# EAGLE design jumper_bed2 (EAGLE 9.6.2)
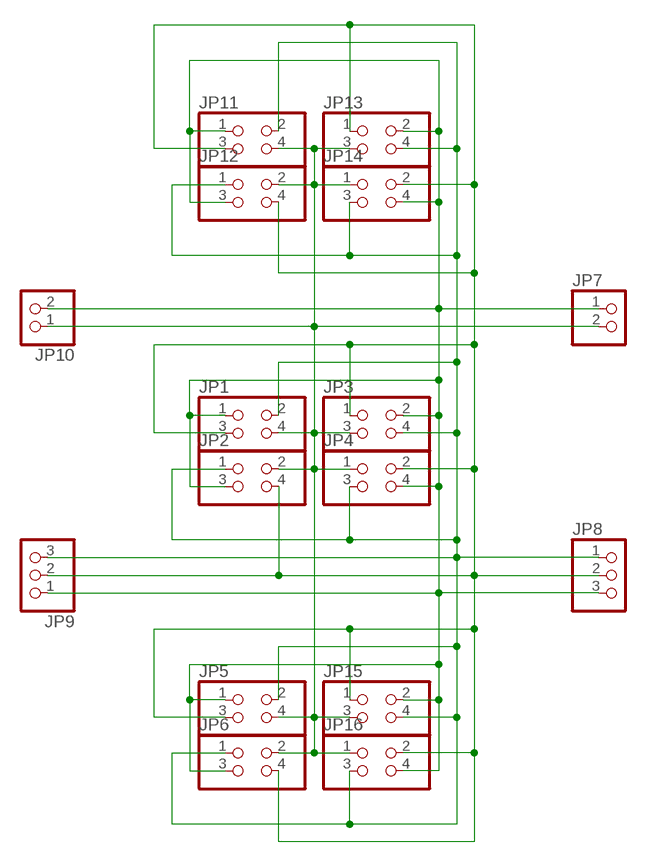
[diagram p0: schematic, sheet 1]

## Parts
JP1  PINHD-2X2  [2X02]
JP2  PINHD-2X2  [2X02]
JP3  PINHD-2X2  [2X02]
JP4  PINHD-2X2  [2X02]
JP5  PINHD-2X2  [2X02]
JP6  PINHD-2X2  [2X02]
JP7  PINHD-1X2/90  [1X02/90]
JP8  PINHD-1X3/90  [1X03/90]
JP9  PINHD-1X31X03/90F  [1X03/90F]
JP10  PINHD-1X21X02/90F  [1X02/90F]
JP11  PINHD-2X2  [2X02]
JP12  PINHD-2X2  [2X02]
JP13  PINHD-2X2  [2X02]
JP14  PINHD-2X2  [2X02]
JP15  PINHD-2X2  [2X02]
JP16  PINHD-2X2  [2X02]

## Nets
GND: JP1.1 JP2.3 JP3.2 JP4.4 JP5.1 JP6.3 JP7.1 JP8.3 JP9.1 JP10.2 JP11.1 JP12.3 JP13.2 JP14.4 JP15.2 JP16.4
SCL: JP1.2 JP2.1 JP3.4 JP4.3 JP5.2 JP6.1 JP8.1 JP9.3 JP11.2 JP12.1 JP13.4 JP14.3 JP15.4 JP16.3
SDA: JP1.3 JP2.4 JP3.1 JP4.2 JP5.3 JP6.4 JP8.2 JP9.2 JP11.3 JP12.4 JP13.1 JP14.2 JP15.1 JP16.2
VCC: JP1.4 JP2.2 JP3.3 JP4.1 JP5.4 JP6.2 JP7.2 JP10.1 JP11.4 JP12.2 JP13.3 JP14.1 JP15.3 JP16.1

## Library data of the parts
JP1-JP6 JP11-JP16 = pinhead2:PINHD-2X2: PIN HEADER
JP7 JP10 = pinhead2:PINHD-1X2: PIN HEADER
JP8 JP9 = pinhead2:PINHD-1X3: PIN HEADER

## Board
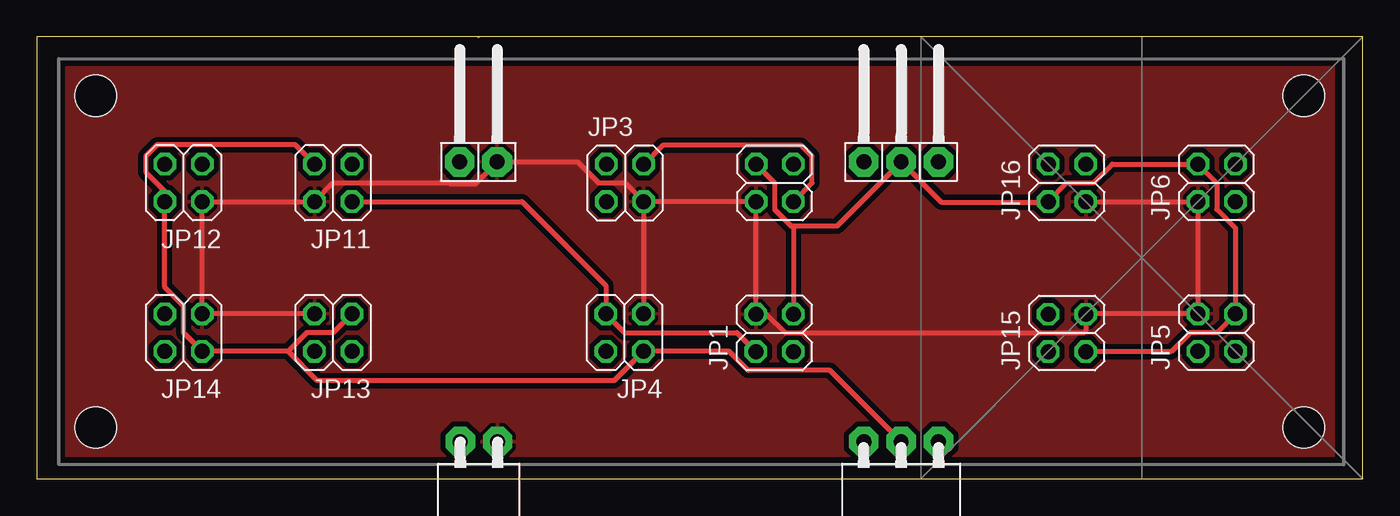
[diagram p1: board, top side]
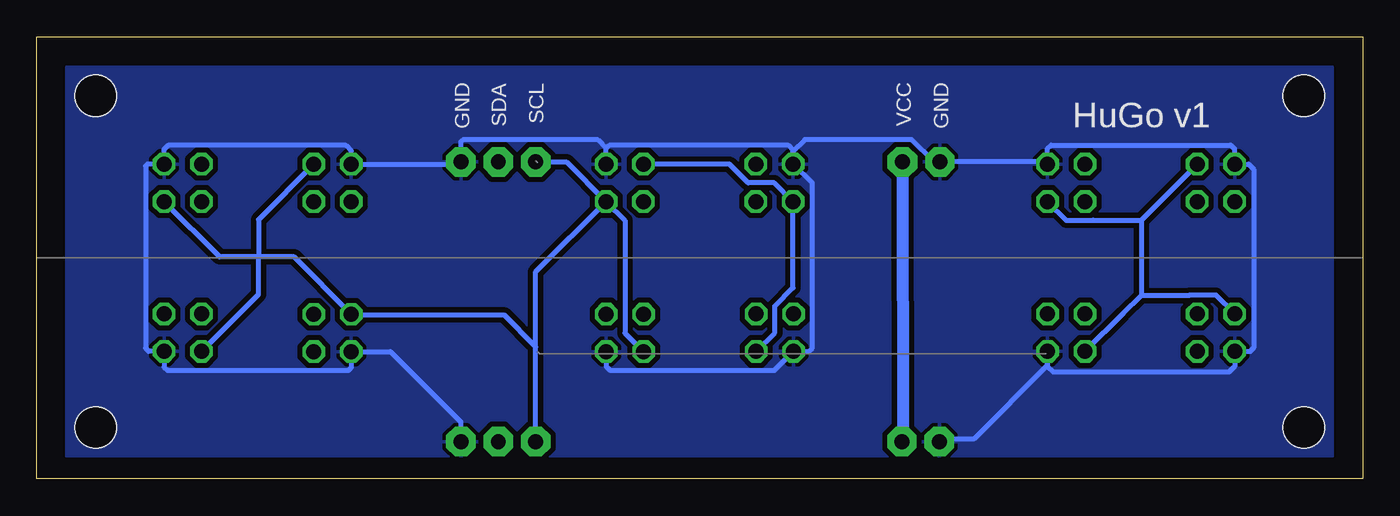
[diagram p2: board, bottom side, seen from below]

Size 90 x 30 mm. Coordinates in mm from the lower left corner, seen from the top.
Outline: 0,0 90,0 90,30 0,30 0,0
Copper layers (1*16): Top 0.035mm / dielectric 1.5mm / Bottom 0.035mm
Design rules "default *": minimum track width 14mil, minimum drill 0.35mm, track to track 14mil, track to pad 13mil, pad to pad 14mil, via to via 14mil, smd to smd 14mil, copper to edge 0mil, drill to drill 15mil, minimum pad ring 10mil, minimum via ring 8mil, stop-mask expansion 4mil, vias tented up to drill 0mil, thermal gap 10mil
Holes 2.8 mm at 86,3.5 86,26 4,26 4,3.5

### Footprints (pad centres in the part's own frame; a part is rotated, then mirrored left to right if it is on the bottom)
2X02 = drill 1.016 octagon: 1 -1.27,-1.27; 2 -1.27,1.27; 3 1.27,-1.27; 4 1.27,1.27
1X02/90 = drill 1.016 pad 1.981 octagon: 1 -1.27,-3.81 | drill 1.016 pad 2.007 octagon: 2 1.27,-3.81
1X03/90 = drill 1.016 pad 1.981 octagon: 1 -2.54,-3.81; 2 0,-3.81; 3 2.54,-3.81
1X03/90F = drill 1.016 pad 1.981 octagon: 1 -2.54,0; 2 0,0; 3 2.54,0
1X02/90F = drill 1.016 pad 1.981 octagon: 1 -1.31,0; 2 1.23,0

### Placement (x,y rotation side)
JP1  50.08,9.91 90 top
JP2  50.09,20.09 90 top
JP3  39.93,20.09 0 top
JP4  39.9,9.93 180 top
JP5  80.09,9.93 90 top
JP6  80.09,20.09 90 top
JP7  29.97,25.32 0 top
JP8  58.67,25.32 0 top
JP9  58.67,2.54 180 top
JP10  29.97,2.54 180 top
JP11  20.12,20.09 180 top
JP12  9.96,20.09 180 top
JP13  20.12,9.93 180 top
JP14  9.96,9.93 180 top
JP15  69.93,9.91 90 top
JP16  69.93,20.09 90 top

### Tracks (layer width: path | path; a pad name or v marks a point on that pad's centre or on a via)
GND
  Bottom 0.356: JP10.2 28.65,2.74 26.36,2.74 21.39,7.72 JP13.2 21.39,7.64 21.01,7.26 9.07,7.26 8.69,7.64 JP14.4 7.62,8.66 7.39,8.89 7.39,21.01 7.74,21.36 JP12.3 8.69,22.38 8.97,22.66 21.16,22.66 21.39,22.43 JP11.1 21.54,21.51 JP7.1 29.11,21.51 30.62,23.02 37.86,23.02 38.66,22.23 JP3.2 | JP3.2 38.66,22.32 38.97,22.63 51.15,22.63 51.36,22.42 JP2.3 51.36,22.45 51.92,23.01 61.1,23.01 61.21,22.9 JP8.3 61.37,21.36 JP16.4 68.66,22.27 69.02,22.63 81.09,22.63 81.36,22.37 JP6.3 82.49,21.36 82.63,21.23 82.63,8.87 82.42,8.66 JP5.1 81.36,7.59 81.13,7.37 68.84,7.37 68.66,7.55 JP15.2 65.99,8.64 61.21,3.86 JP9.1 | JP3.2 37.36,20.07 37.36,8.87 37.57,8.66 JP4.4 39.92,7.37 51.09,7.37 51.35,7.63 JP1.1
  pour Bottom: 2.01,27.97 88.04,27.97 88.04,1.52 2.01,1.52
SCL
  Top 0.356: JP11.2 32.93,18.82 38.63,13.12 JP4.3 38.63,11.18 39.88,9.93 47.52,9.93 JP1.2 | JP3.4 42.48,22.63 51.88,22.63 52.63,21.89 52.63,20.09 JP2.1
  Bottom 0.356: 15.02,17.56 15.02,12.45 | 15.02,17.56 JP12.1 | 15.02,12.45 16.27,11.2 JP13.4 | 15.02,12.45 11.78,12.45 11.75,12.47 9.96,12.47 JP14.3 | 15.02,17.56 18.31,17.56 18.32,17.55 20.12,17.55 JP11.2 | JP8.1 54.05,21.51 JP2.1 | JP1.2 48.83,8.64 50.08,9.89 50.08,17.54 JP2.1 | JP2.1 56.13,14.05 JP9.3 56.13,8.97 58.3,11.13 68.61,11.13 JP15.4 72.54,15.06 74.95,15.06 | JP6.1 77.6,15.06 74.95,15.06 | JP16.3 74.95,17.6 74.95,15.06 | JP5.2 74.95,12.52 74.95,15.06
SDA
  Top 0.356: JP11.3 17.53,22.68 8.18,22.68 7.39,21.9 7.39,20.82 8.69,19.53 JP12.4 8.69,13 9.96,11.73 9.96,9.93 JP14.2 17.05,8.66 | JP13.1 20.12,9.93 18.32,9.93 17.05,8.66 | 17.05,8.66 19.03,6.68 39.19,6.68 JP4.2 46.99,8.66 48.28,7.37 53.84,7.37 JP9.2 | JP2.4 50.09,20.09 50.09,18.3 51.22,17.16 | JP1.3 51.35,17.04 51.22,17.16 | 51.22,17.16 54.32,17.16 JP8.2 61.4,18.79 68.62,18.79 JP16.2 69.93,20.09 71.72,20.09 72.99,21.36 JP6.4 80.09,20.09 80.09,18.3 81.36,17.02 JP5.3 80.09,9.93 78.29,9.93 77,8.64 JP15.1
  Bottom 0.356: JP4.2 39.9,9.93 39.9,11.73 38.66,12.97 JP3.1 39.93,20.09 41.73,20.09 42.99,21.36 JP2.4
VCC
  Top 0.356: JP13.3 JP14.1 JP12.2 JP11.4 20.12,20.09 28,20.09 28.08,20.02 29.78,20.02 31.24,21.48 31.28,21.48 JP7.2 36.71,21.51 38.13,20.09 39.93,20.09 JP3.3 | JP3.3 JP2.2 48.81,18.81 JP1.4 49.53,11.18 50.8,9.91 50.82,9.91 51.88,9.91 71.06,9.91 71.2,10.04 JP15.3 71.22,11.2 JP5.4 JP6.2 JP16.1 | JP3.3 41.2,11.23 JP4.1
  Bottom 0.406: 31.22,2.61 JP10.1
  Bottom 0.813: JP7.2 31.22,2.61
  pour Top: 2.01,27.97 88.04,27.97 88.04,1.52 2.01,1.52

### Text on the board
bNames: GND | VCC | SCL | SDA | GND | HuGo v1